# EAGLE design VCclipping_2 (EAGLE 9.1.1)
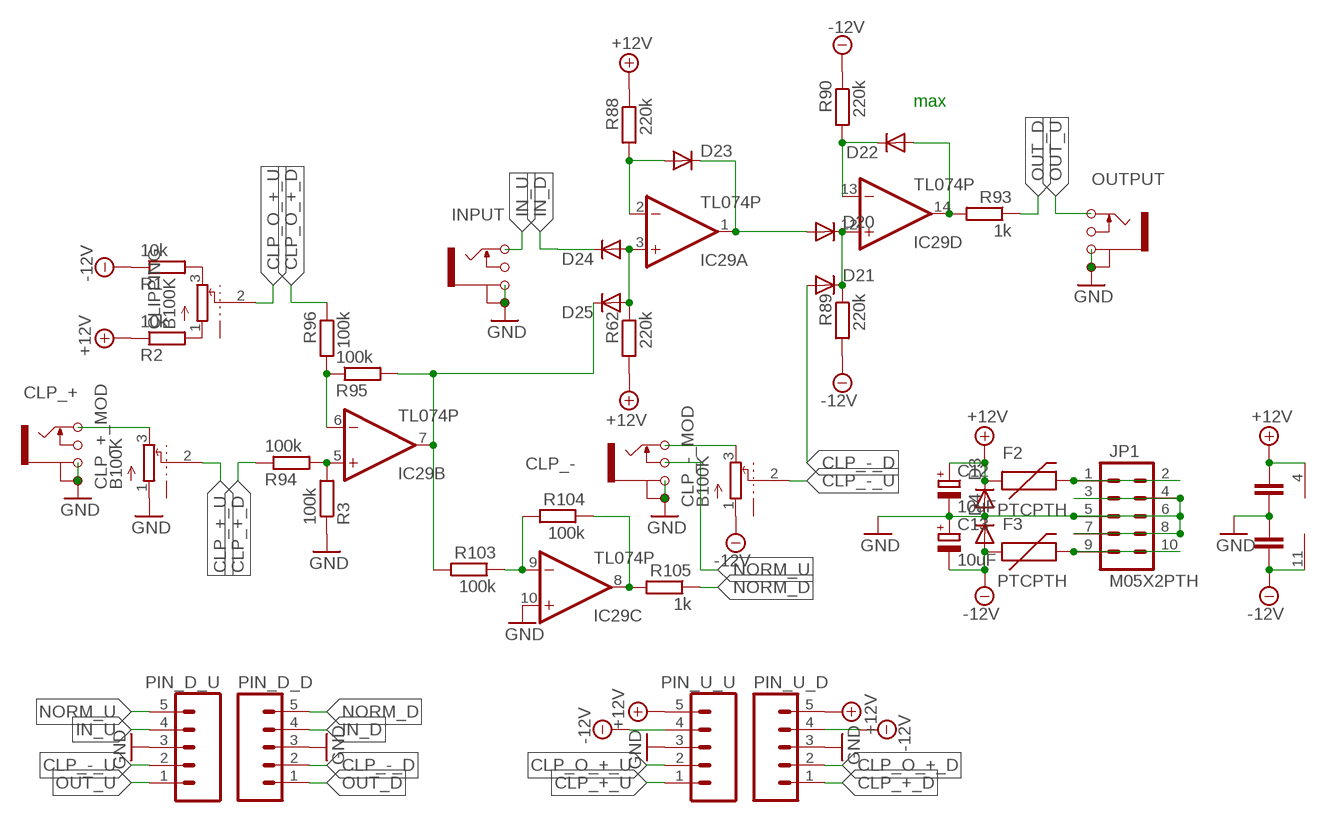
[diagram p0: schematic, sheet 1]

## Parts
C6  100nF  C-EU050-024X044  [C050-024X044]
C7  100nF  C-EU050-024X044  [C050-024X044]
C12  10uF  CPOL-EUE2,5-6E  [E2,5-6E]
C13  10uF  CPOL-EUE2,5-6E  [E2,5-6E]
CLIPPING  B100K  POT_ALPHAPOT_ALPHA  [POT_ALPHA]
CLP_+  JACK_MONOJACK_MONO  [JACK_MONO]
CLP_+_MOD  B100K  POT_ALPHAPOT_ALPHA  [POT_ALPHA]
CLP_-  JACK_MONOJACK_MONO  [JACK_MONO]
CLP_-_MOD  B100K  POT_ALPHAPOT_ALPHA  [POT_ALPHA]
D3  DIODE-D-7.5  [D-7.5]
D4  DIODE-D-7.5  [D-7.5]
D20  DIODE-D-5  [D-5]
D21  DIODE-D-5  [D-5]
D22  DIODE-D-5  [D-5]
D23  DIODE-D-5  [D-5]
D24  DIODE-D-5  [D-5]
D25  DIODE-D-5  [D-5]
F2  PTCPTH  [PTC]
F3  PTCPTH  [PTC]
IC29  TL074P  [DIL14]
INPUT  JACK_MONOJACK_MONO  [JACK_MONO]
JP1  M05X2PTH  [AVR_ICSP]
OUTPUT  JACK_MONOJACK_MONO  [JACK_MONO]
PIN_D_D  M05PTH  [1X05]
PIN_D_U  M05PTH  [1X05]
PIN_U_D  M05PTH  [1X05]
PIN_U_U  M05PTH  [1X05]
R1  10k  R-EU_0204/5  [0204/5]
R2  10k  R-EU_0204/5  [0204/5]
R3  100k  R-EU_0204/5  [0204/5]
R62  220k  R-EU_0204/5  [0204/5]
R88  220k  R-EU_0204/5  [0204/5]
R89  220k  R-EU_0204/5  [0204/5]
R90  220k  R-EU_0204/5  [0204/5]
R93  1k  R-EU_0204/5  [0204/5]
R94  100k  R-EU_0204/5  [0204/5]
R95  100k  R-EU_0204/5  [0204/5]
R96  100k  R-EU_0204/5  [0204/5]
R103  100k  R-EU_0204/5  [0204/5]
R104  100k  R-EU_0204/5  [0204/5]
R105  1k  R-EU_0204/5  [0204/5]

## Nets
+12V: C6.2 C12.+ D3.C F2.P$1 IC29.4(P:V+) PIN_U_D.5 PIN_U_U.5 R2.1 R62.2 R88.1
-12V: C7.1 C13.- CLP_-_MOD.1 D4.A F3.P$1 IC29.11(P:V-) PIN_U_D.4 PIN_U_U.4 R1.1 R89.2 R90.1
CLP_+_D: PIN_U_D.1 R94.1
CLP_+_U: CLP_+_MOD.2 PIN_U_U.1
CLP_-_D: D21.A PIN_D_D.2
CLP_-_U: CLP_-_MOD.2 PIN_D_U.2
CLP_O_+_D: PIN_U_D.2 R96.1
CLP_O_+_U: CLIPPING.2 PIN_U_U.2
GND: C6.1 C7.2 C12.- C13.+ CLP_+.G1 CLP_+.G2 CLP_+_MOD.1 CLP_-.G1 CLP_-.G2 D3.A D4.C IC29.10(C:+IN) INPUT.G1 INPUT.G2 JP1.3 JP1.4 JP1.5 JP1.6 JP1.7 JP1.8 OUTPUT.G1 OUTPUT.G2 PIN_D_D.3 PIN_D_U.3 PIN_U_D.3 PIN_U_U.3 R3.1
IN_D: D24.C PIN_D_D.4
IN_U: INPUT.T PIN_D_U.4
N$1: CLIPPING.3 R1.2
N$2: CLIPPING.1 R2.2
N$3: IC29.5(B:+IN) R3.2 R94.2
N$4: F2.P$2 JP1.1 JP1.2
N$6: F3.P$2 JP1.9 JP1.10
N$76: D24.A D25.A IC29.3(A:+IN) R62.1
N$78: D23.A IC29.2(A:-IN) R88.2
N$84: D20.C D21.C IC29.12(D:+IN) R89.1
N$105: D22.C IC29.13(D:-IN) R90.2
N$106: D22.A IC29.14(D:OUT) R93.2
N$107: CLP_-.T CLP_-_MOD.3
N$108: D20.A D23.C IC29.1(A:OUT)
N$110: IC29.6(B:-IN) R95.1 R96.2
N$113: D25.C IC29.7(B:OUT) R95.2 R103.2
N$115: CLP_+.T CLP_+_MOD.3
N$124: IC29.9(C:-IN) R103.1 R104.2
N$125: IC29.8(C:OUT) R104.1 R105.2
NORM_D: PIN_D_D.5 R105.1
NORM_U: CLP_-.SW PIN_D_U.5
OUT_D: PIN_D_D.1 R93.1
OUT_U: OUTPUT.T PIN_D_U.1
Unconnected: CLIPPING.P$1 CLIPPING.P$2 CLP_+.SW CLP_+_MOD.P$1 CLP_+_MOD.P$2 CLP_-_MOD.P$1 CLP_-_MOD.P$2 INPUT.SW OUTPUT.SW

## Notes on the sheet
- max

## Library data of the parts
C6 C7 = rcl:C-EU: CAPACITOR, European symbol
C12 C13 = rcl:CPOL-EU: POLARIZED CAPACITOR, European symbol
CLIPPING CLP_+_MOD CLP_-_MOD = BASTL_POTS:POT_ALPHA: "A/B""value"_"height"_"D(centrer detent)"_"W(white mark)"; ASSEMBLED: yes; TYPE: THT
CLP_+ CLP_- INPUT OUTPUT = BASTL_CONNECTORS:JACK_MONO; ASSEMBLED: yes; ODOO: PJ301BM; TYPE: THT
D3 D4 D20-D25 = diode:DIODE-: DIODE
F2 F3 = SparkFun-PowerIC:PTC: Resettable Fuse PTC Resettable Fuse. Spark Fun Electronics SKU : COM-08357
IC29 = linear:TL074: OP AMP
JP1 = SparkFun-Connectors:M05X2: Header 5x2 Standard 10-pin dual row 0.1" header. Commonly used with AVR-ISP. Use with Spark Fun Electronics SKU: PRT-00778
PIN_D_D PIN_D_U PIN_U_D PIN_U_U = SparkFun-Connectors:M05: Header 5 Standard 5-pin 0.1" header. Use with straight break away headers (SKU : PRT-00116), right angle break away headers (PRT-00553), swiss pins (PRT-00743), machine pins (PRT-00117), and female headers (PRT-00115). Molex polarized connector foot print use with SKU : PRT-08230 with associated crimp pins and housings.
R1-R3 R62 R88-R90 R93-R96 R103-R105 = rcl:R-EU_: RESISTOR, European symbol

## Board
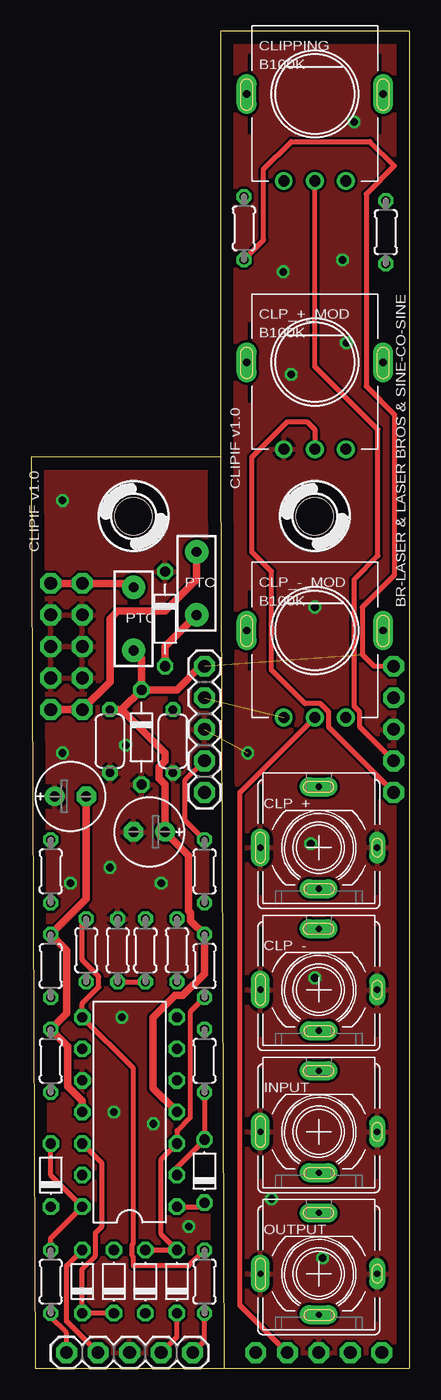
[diagram p1: board, top side]
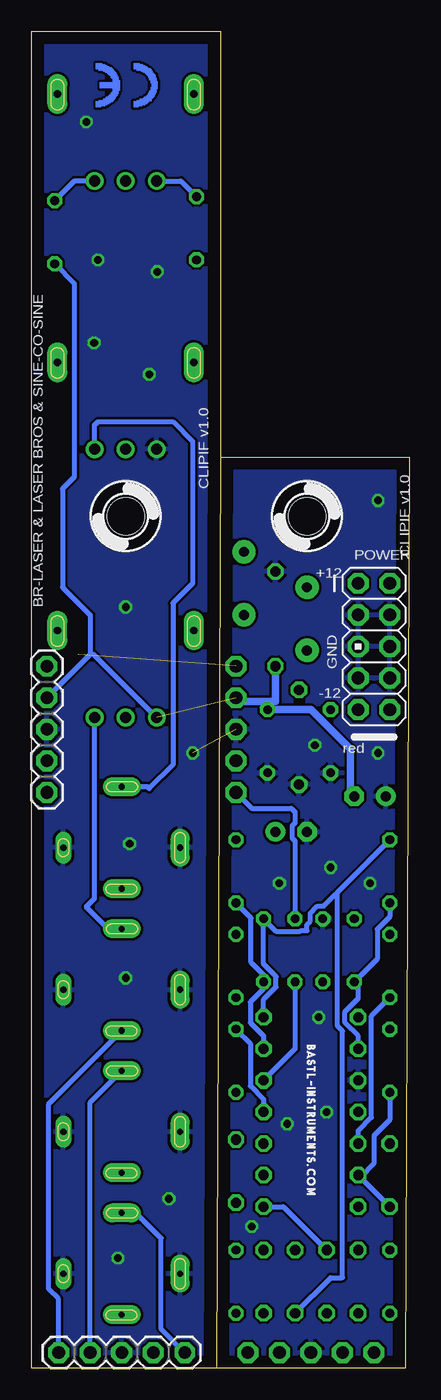
[diagram p2: board, bottom side, seen from below]

Size 30.48 x 107.63 mm. Coordinates in mm from the lower left corner, seen from the top.
Outline: 30.46,0 15.56,0 15.24,73.33
Outline: 30.46,107.62 15.24,107.63 15.24,73.33
Outline: 15.24,73.33 0,73.33 0.32,0 15.54,0
Outline: 30.48,107.62 30.48,0
Copper layers (1*16): Top 0.035mm / dielectric 1.5mm / Bottom 0.035mm
Design rules "default": minimum track width 10mil, minimum drill 24mil, track to track 8mil, track to pad 8mil, pad to pad 8mil, via to via 8mil, smd to smd 8mil, copper to edge 40mil, drill to drill 8mil, minimum pad ring 10mil, minimum via ring 8mil, stop-mask expansion 4mil, vias tented up to drill 0mil, thermal gap 10mil

### Footprints (pad centres in the part's own frame; a part is rotated, then mirrored left to right if it is on the bottom)
C050-024X044 = drill 0.7 octagon: 1 -2.54,0; 2 2.54,0
E2,5-6E = drill 0.813 pad 1.575: + -1.27,0 | drill 0.813 pad 1.575 octagon: - 1.27,0
POT_ALPHA = drill 0.9 pad 1.422: 1 -2.5,0; 2 0,0; 3 2.5,0 | drill 0.6 pad 1.6 long: P$1 -5.5,7; P$2 5.5,7
JACK_MONO = drill 0.5 pad 1.524 long: G1 -4.7,0; SW 0,-3.3; T 0,4.9 | drill 0.5 pad 1.27 long: G2 4.7,0
D-7.5 = drill 0.813 octagon: A 3.81,0; C -3.81,0
D-5 = drill 0.813 octagon: A 2.54,0; C -2.54,0
PTC = drill 0.8 pad 1.88: P$1 -2.54,0; P$2 2.54,0
DIL14 = drill 0.813 octagon: 1 -7.62,-3.81; 2 -5.08,-3.81; 3 -2.54,-3.81; 4 0,-3.81; 5 2.54,-3.81; 6 5.08,-3.81; 7 7.62,-3.81; 8 7.62,3.81; 9 5.08,3.81; 10 2.54,3.81; 11 0,3.81; 12 -2.54,3.81; 13 -5.08,3.81; 14 -7.62,3.81
AVR_ICSP = drill 1.016 pad 1.676 octagon: 1 -1.27,5.08; 2 1.27,5.08; 3 -1.27,2.54; 4 1.27,2.54; 5 -1.27,0; 6 1.27,0; 7 -1.27,-2.54; 8 1.27,-2.54; 9 -1.27,-5.08; 10 1.27,-5.08
1X05 = drill 1.016 pad 1.676 octagon: 1 0,0; 2 2.54,0; 3 5.08,0; 4 7.62,0; 5 10.16,0
0204/5 = drill 0.7 octagon: 1 -2.54,0; 2 2.54,0
3MM_HOLE = hole 3: 0,0

### Placement (x,y rotation side)
C6  6.35,50.48 90 top
C7  11.43,50.48 270 top
C12  9.52,43.18 180 top
C13  3.17,46.04 0 top
CLIPPING  22.86,95.57 0 top
CLP_+  23.18,41.91 0 top
CLP_+_MOD  22.86,73.98 0 top
CLP_-  23.18,30.48 0 top
CLP_-_MOD  22.86,52.39 0 top
D3  8.89,50.8 270 top
D4  10.79,60.33 270 top
D20  6.67,6.99 90 top
D21  4.13,6.99 90 top
D22  1.59,15.56 90 top
D23  13.97,15.88 90 top
D24  11.75,6.99 90 top
D25  9.21,6.99 90 top
F2  8.25,60.33 90 top
F3  13.33,63.18 90 top
IC29  7.94,20.64 90 top
INPUT  23.18,19.05 0 top
JP1  2.86,58.1 0 bottom
OUTPUT  23.18,7.62 0 top
PIN_D_D  2.86,1.27 0 top
PIN_D_U  18.1,1.27 180 bottom
PIN_U_D  13.97,46.35 90 top
PIN_U_U  29.21,46.35 90 bottom
R1  28.57,91.44 90 top
R2  17.14,91.76 90 top
R3  6.98,33.66 270 top
R62  13.97,32.38 90 top
R88  13.97,24.77 270 top
R89  1.59,32.38 90 top
R90  1.59,24.77 270 top
R93  1.59,6.99 90 top
R94  9.21,33.66 270 top
R95  11.75,33.66 90 top
R96  13.97,40.01 270 top
R103  1.59,40.01 90 top
R104  4.44,33.66 270 top
R105  13.97,6.99 90 top
U$1  [CE_COPPER_4]  20.32,105.09 180 bottom
U$4  [BASTL_WEB_3]  8.25,26.04 270 bottom
U$6  [3MM_HOLE]  8.25,68.58 0 top
U$9  [3MM_HOLE]  22.86,68.58 0 top

### Tracks (layer width: path | path; a pad name or v marks a point on that pad's centre or on a via)
+12V  (1 unrouted)
  Top 0.406: R2.1 18.73,90.81 18.73,96.52 20.95,98.74 27.31,98.74 29.26,96.79 26.99,94.51 26.99,79.06 29.26,76.78 29.26,63.87 26.67,61.28 26.67,57.47 27.62,56.52 PIN_U_U.5
  Top 0.61: D3.C 8.89,57.15 F2.P$1 | D3.C 11.75,54.61 13.65,56.52 PIN_U_D.5 | 7.3,53.02 C6.2 | D3.C 7.3,53.02 | 7.3,53.02 10.79,49.53 10.79,48.88 10.32,48.4 10.32,47.48 10.79,47.01 C12.+ 12.7,41.27 12.7,36.81 12.86,36.66 12.86,36.03 R62.2 13.97,31.77 12.21,30 11.59,30 9.84,28.26 9.84,22.54 IC29.4
  Bottom 0.406: R88.1 12.81,26.15 12.81,22.74 11.75,21.67 IC29.4
-12V  (1 unrouted)
  Top 0.61: F3.P$1 10.79,58.1 D4.A | IC29.11 4.13,21.52 2.96,22.69 2.96,25.93 R90.1 2.86,28.57 2.86,33.66 R89.2 4.44,37.78 C13.-
  Bottom 0.406: R1.1 26.99,87.31 26.99,71.75 27.94,70.8 27.94,62.87 25.72,60.64 25.72,57.47 | 25.72,57.47 PIN_U_U.4 | CLP_-_MOD.1 25.44,57.47 25.72,57.47
  Bottom 0.61: D4.A 10.79,53.66 11.11,53.66 11.43,53.66 | 11.43,53.66 C7.1 7.94,53.02 4.76,49.85 4.76,46.35 C13.- | PIN_U_D.4 13.65,53.66 11.43,53.66
CLP_+_D
  Bottom 0.406: PIN_U_D.1 12.7,45.09 9.53,45.09 9.21,44.77 9.21,43.92 9.45,43.67 9.45,42.69 9.21,42.44 R94.1
CLP_+_U
  Top 0.406: PIN_U_U.1 23.98,51.59 23.98,52.85 23.32,53.51 22.06,53.51 19.37,56.2 19.37,64.14 17.78,65.72 17.78,73.34 20.64,76.2 22.23,76.2 22.86,75.56 CLP_+_MOD.2
CLP_-_D
  Top 0.406: PIN_D_D.2 2.86,3.81 2.86,8.26 D21.A
CLP_-_U
  Top 0.406: PIN_D_U.2 16.83,5.08 16.83,46.35 CLP_-_MOD.2
CLP_O_+_D
  Top 0.406: PIN_U_D.2 12.38,47.31 12.38,44.13 R96.1
CLP_O_+_U
  Top 0.406: PIN_U_U.2 26.48,51.63 26.48,52.85 26.03,53.29 26.03,63.5 27.94,65.41 27.94,75.56 22.86,80.64 CLIPPING.2
GND  (via drill 0.61)  (1 unrouted)
  other vias: 20.32,88.27 25.08,89.22 26.03,100.33 20.95,80.01 25.4,82.55 22.86,61.28 17.46,49.53 22.54,42.23 22.86,31.43 23.49,8.89 19.37,13.65 12.7,11.43 9.84,19.68 6.67,20.64 7.3,28.26 6.35,40.32 10.48,39.05 3.17,39.05 2.54,49.53 7.62,50.16 2.54,69.85
  pour Bottom: 35.24,-1.71 -11.11,-2.54 -11.11,109.54 35.24,109.54
  pour Top: 34.29,-1.95 -10.79,-2.22 -10.79,109.54 34.29,109.54
IN_D
  Top 0.406: PIN_D_D.4 11.75,2.54 D24.C
IN_U
  Bottom 0.406: PIN_D_U.4 25.72,21.41 INPUT.T
N$1
  Bottom 0.406: CLIPPING.3 26.99,95.57 R1.2
N$2
  Bottom 0.406: CLIPPING.1 18.41,95.57 R2.2
N$3
  Top 0.406: R3.2 R94.2
  Bottom 0.406: R94.2 9.21,25.72 IC29.5
N$4
  Top 0.61: JP1.2 JP1.1 7.94,63.18 F2.P$2
N$6
  Top 0.61: JP1.10 JP1.9 6.35,55.24 6.35,60.33 6.99,60.96 10.79,60.96 13.33,63.5 F3.P$2
N$76
  Top 0.406: R62.1 12.81,28.69 12.81,20.2 11.75,19.13 IC29.3 10.48,16.83 10.48,10.79 D24.A D25.A
N$78
  Top 0.406: R88.2 D23.A 11.75,16.19 IC29.2
N$84
  Top 0.406: D20.C D21.C 4.13,8.02 5.19,9.08 5.19,10.91 5.72,11.43 5.72,16.51 IC29.12
  Bottom 0.406: R89.1 3.06,28.37 3.06,20.2 4.13,19.13 IC29.12
N$105
  Bottom 0.406: D22.C 3.97,15.4 | 3.97,15.4 IC29.13 | 3.97,15.4 2.86,16.51 2.86,18.73 1.59,20 R90.2
N$106
  Top 0.406: R93.2 1.59,10.48 IC29.14 1.59,15.56 D22.A
N$107
  Bottom 0.406: CLP_-.T 24.27,35.38 26.03,37.15 25.36,37.82 CLP_-_MOD.3
N$108
  Top 0.406: IC29.1 13.65,13.02 D23.C
  Bottom 0.406: IC29.1 10.16,13.02 D20.A
N$110
  Bottom 0.406: IC29.6 11.75,26.75 12.81,27.82 12.81,29.48 11.75,30.55 R95.1 11.75,31.68 12.76,32.69 12.76,36.25 R96.2
N$113
  Bottom 0.406: IC29.7 11.75,29.69 10.74,30.7 10.74,31.53 11.75,32.54 R95.2 10.74,35.19 8.79,35.19 8.73,35.24 8.25,35.24 8.25,35.72 8,35.98 8,36.61 7.4,37.2 6.93,37.2 4.92,39.21 | 4.92,39.21 R103.2 | D25.C 6.35,7.3 5.4,7.3 5.4,27.16 5.8,27.56 5.8,38.33 4.92,39.21
N$115
  Bottom 0.406: CLP_+_MOD.3 25.36,75.92 25.08,76.2 19.05,76.2 17.46,74.61 17.46,63.18 19.05,61.59 19.05,48.58 20.95,46.67 21.09,46.81 CLP_+.T
N$124
  Bottom 0.406: R103.1 1.59,36.35 2.6,35.34 2.6,32.96 R104.2 4.13,30.8 4.13,29.77 5.19,28.7 5.19,27.82 4.13,26.75 IC29.9
N$125
  Top 0.406: R105.2 12.7,8.26 8.25,8.26 8.25,8.97 8.14,9.08 8.14,9.97 8.25,10.08 8.25,24.13 IC29.8 4.13,29.37 5.46,30.7 5.46,31.53 4.13,32.86 4.13,35.88 R104.1
NORM_D
  Top 0.406: PIN_D_D.5 13.97,2.22 R105.1
NORM_U
  Bottom 0.406: PIN_D_U.5 28.26,5.59 29.05,6.37 29.05,21.31 CLP_-.SW
OUT_D
  Top 0.406: PIN_D_D.1 2.86,2.86 1.5,4.21 1.5,4.36 R93.1
OUT_U
  Bottom 0.406: PIN_D_U.1 20,3.17 20,10.48 22.04,12.52 OUTPUT.T

### Text on the board
tPlace: CLIPIF v1.0 | CLIPIF v1.0 | PTC | BR-LASER & LASER BROS & SINE-CO-SINE | PTC
bPlace: CLIPIF v1.0 | CLIPIF v1.0 | POWER | +12 | BR-LASER & LASER BROS & SINE-CO-SINE | GND | -12 | red